# Altium schematic sheet M1.SchDoc
size A
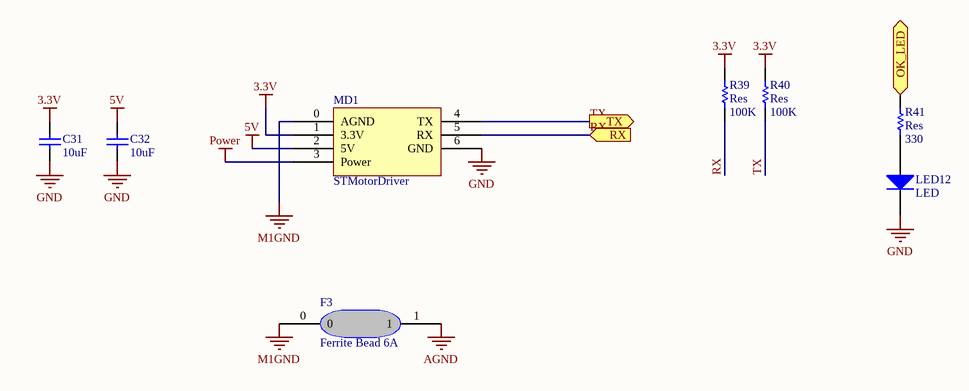
[diagram p0: M1.SchDoc]

## Parts
C31  value 10uF  [2012[0805]]  (hidden comment: Cap_UP)
C32  value 10uF  [2012[0805]]  (hidden comment: Cap_UP)
F3  Ferrite Bead 6A  [f6A]
LED12  LED  [2012[0805]]
MD1  STMotorDriver  [MotorDriver]
R39  Res  value 100K  [2012[0805]]
R40  Res  value 100K  [2012[0805]]
R41  Res  value 330  [2012[0805]]

## Ports
OK_LED (in), RX (in), TX (out)

## Nets
3.3V: C31.2 MD1.1(3.3V) R39.2 R40.2
5V: C32.2 MD1.2(5V)
AGND: F3.1
GND: C31.1 C32.1 LED12.2(K) MD1.6(GND)
M1GND: F3.0 MD1.0(AGND)
Power: MD1.3(Power)
OK_LED: R41.1 ; port OK_LED
RX: MD1.5(RX) R39.1 ; port RX
TX: MD1.4(TX) R40.1 ; port TX
NetLED12_1: LED12.1(A) R41.2

## Library data of the parts
C31 C32 = Cap_UP: Capacitor; Published: 8-Jun-2000; LatestRevisionDate: 17-Jul-2002; LatestRevisionNote: Re-released for DXP Platform.; PackageReference: RAD-0.3; Publisher: Altium Limited
F3 = F6A
LED12 = Diode: 1 Amp General Purpose Rectifier; Revision 1: 11-Jul-2000: SIM Model Added.; Revision 2: 17-Jul-2002: Re-released for DXP Platform.; Package Information: Latest Revision: Aug-1999; Code - JEDEC: DO-204-AL; Published: 8-Jun-2000; Datasheet: Latest Revision: 1998; Package Reference: DO-41; Publisher: Altium Limited
R39-R41 = Res: Semiconductor Resistor; Published: 8-Jun-2000; LatestRevisionDate: 17-Jul-2002; LatestRevisionNote: Re-released for DXP Platform.; PackageReference: AXIAL-0.5; Publisher: Altium Limited